# Altium schematic sheet filter.SchDoc
size A; SheetNumber: 11; SheetTotal: 13
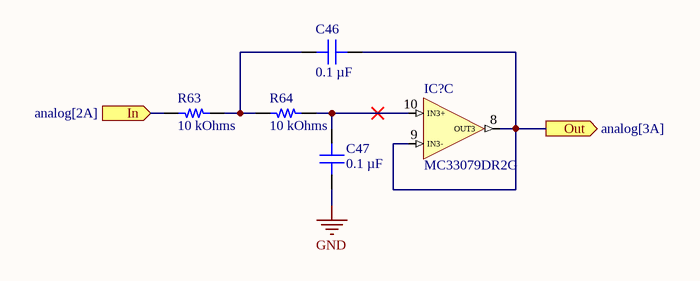
[diagram p0: filter.SchDoc]

## Parts
C46  0.1 µF  [CAP 1206_3216 - 0.8MM]
C47  0.1 µF  [CAP 1206_3216 - 0.8MM]
IC?  MC33079DR2G  [SOIC127P600X175-14N]  (part C of 5)
R63  10 kOhms  [YAGEO RES 1206_3216]
R64  10 kOhms  [YAGEO RES 1206_3216]

## Ports
In (in, see analog[2A]), Out (out, see analog[3A])

## Nets
GND: C47.2
In: R63.2 ; port In
Out: C46.1 IC?.8(OUT3) IC?.9(IN3-) ; port Out
NetC46_2: C46.2 R63.1 R64.2
NetC47_1: C47.1 IC?.10(IN3+) R64.1

## Library data of the parts
C46 C47 = 885012208087: CAP CER 0.1UF 50V X7R 1206; manufacturer: Würth Elektronik; Tolerance: ±10%; Part Number: 885012208087; Capacitance: 0.1 µF; Applications: General Purpose; componentlink1description: Datasheet; componentlink1url: https://katalog.we-online.de/pbs/datasheet/885012208087.pdf; componentlink2description: DigiKey Link; componentlink2url: https://www.digikey.com/en/products/detail/würth-elektronik/885012208087/5453982; Device Package: 1206 (3216 Metric); lastupdated: 6/4/2024 19:10:27; Lifecycle Status: Active; Minimum Order: 1; Mounting Type: Surface Mount, MLCC; Operating Temperature: -55°C ~ 125°C; Package / Case: 1206 (3216 Metric); packaging: TapeAndReel; partid: 20879; Part Status: Active; price: 0.06; series: WCAP-CSGP; Size / Dimension: 0.126" L x 0.063" W (3.20mm x 1.60mm); Supplier 1: DigiKey; Supplier Part Number 1: 732-8127-1-ND; Temperature Coefficient: X7R; Thickness (Max): 0.035" (0.90mm); value: 0.1 µF; Voltage - Rated: 50V
IC? = MC33079DR2G: Integrated Circuit; Manufacturer_Name: onsemi; Datasheet Link: https://www.onsemi.com/pub/Collateral/MC33078-D.PDF; Height: 1.75mm; Manufacturer_Part_Number: MC33079DR2G; Mouser Part Number: 863-MC33079DR2G; Mouser Price/Stock: https://www.mouser.co.uk/ProductDetail/onsemi/MC33079DR2G?qs=g2rIOKKlpoa9LEjz5JLClg%3D%3D; Arrow Part Number: MC33079DR2G; Arrow Price/Stock: https://www.arrow.com/en/products/mc33079dr2g/on-semiconductor?region=asia
R63 R64 = RT1206FRE0710KL: RES SMD 10K OHM 1% 1/4W 1206; Manufacturer: Yageo; Power (Watts): 0.25W, 1/4W; Temperature Coefficient: ±50ppm/°C; Part Number: RT1206FRE0710KL; ComponentLink1Description: Datasheet; ComponentLink1URL: https://www.yageo.com/upload/media/product/productsearch/datasheet/rchip/PYu-RT_1-to-0.01_RoHS_L_11.pdf; ComponentLink2Description: DigiKey Link; ComponentLink2URL: https://www.digikey.com/en/products/detail/yageo/RT1206FRE0710KL/1082868; Composition: Thin Film; Device Package: 1206 (3216 Metric); Height - Seated (Max): 0.026" (0.65mm); LastUpdated: 7/25/2024 09:21:28; Lifecycle Status: Active; Minimum Order: 1; Number of Terminations: 2; Operating Temperature: -55°C ~ 155°C; Package / Case: 1206 (3216 Metric); Packaging: TapeAndReel; PartId: 38903; Part Status: Active; Price: 0.01; Resistance: 10 kOhms; Series: RT; Size / Dimension: 0.122" L x 0.063" W (3.10mm x 1.60mm); Supplier 1: DigiKey; Supplier Part Number 1: YAG1242CT-ND; Supplier Device Package: 1206; Tolerance: ±1%; Value: 10 kOhms